# Altium schematic sheet 08.C8051_TIMER_LCD_V1.0.0.SchDoc
size A4
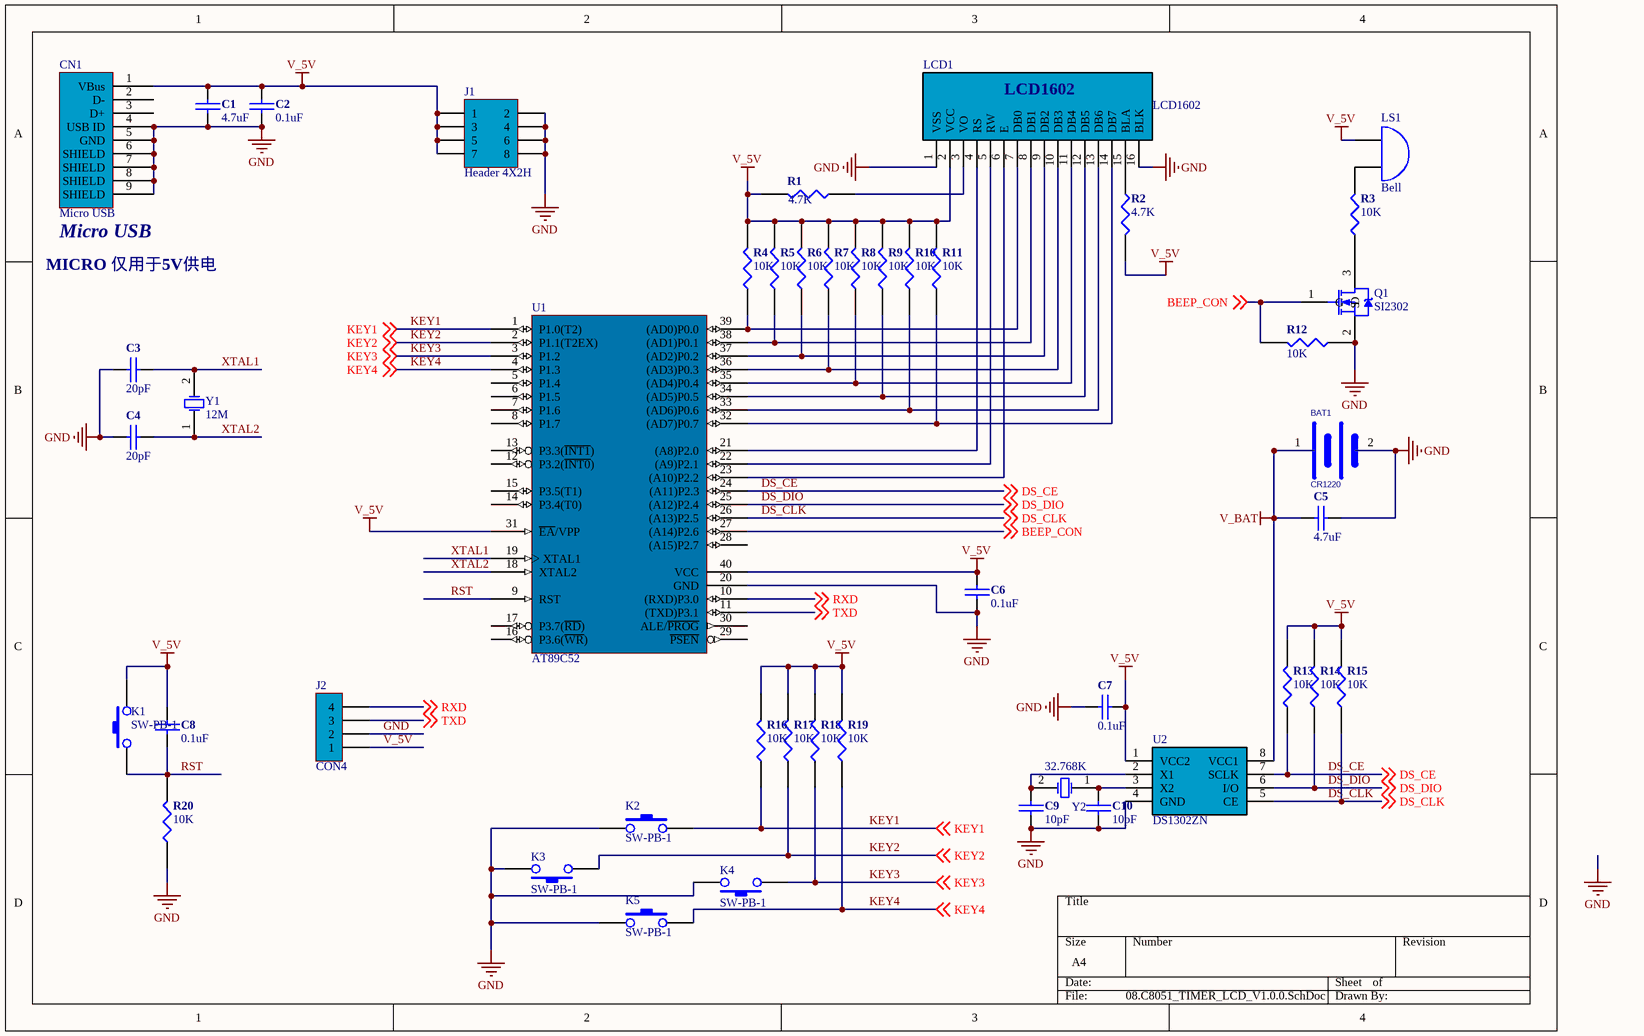
[diagram p0: 08.C8051_TIMER_LCD_V1.0.0.SchDoc]

## Parts
BAT1  CR1220  [BATTERY-CELL]
C1  4.7uF  [C0603]
C2  0.1uF  [C0603]
C3  20pF  [C0603]
C4  20pF  [C0603]
C5  4.7uF  [C0603]
C6  0.1uF  [C0603]
C7  0.1uF  [C0603]
C8  0.1uF  [C0603]
C9  10pF  [C0603]
C10  10pF  [C0603]
CN1  Micro USB  [MICRO_USB_9]
J1  Header 4X2H  [HDR2X4]
J2  CON4  [HDR1X4]
K1  SW-PB-1  [SWITCH_1]
K2  SW-PB-1  [SWITCH_1]
K3  SW-PB-1  [SWITCH_1]
K4  SW-PB-1  [SWITCH_1]
K5  SW-PB-1  [SWITCH_1]
LCD1  LCD1602  [LCD1602]
LS1  Bell  [BUZZER]
Q1  SI2302  [SOT_23(N)]
R1  4.7K  [R0603]
R2  4.7K  [R0603]
R3  10K  [R0603]
R4  10K  [R0603]
R5  10K  [R0603]
R6  10K  [R0603]
R7  10K  [R0603]
R8  10K  [R0603]
R9  10K  [R0603]
R10  10K  [R0603]
R11  10K  [R0603]
R12  10K  [R0603]
R13  10K  [R0603]
R14  10K  [R0603]
R15  10K  [R0603]
R16  10K  [R0603]
R17  10K  [R0603]
R18  10K  [R0603]
R19  10K  [R0603]
R20  10K  [R0603]
U1  AT89C52  [DIP40]
U2  DS1302ZN  [SOP-8]
Y1  12M  [XTAL]
Y2  32.768K  [XTAL_32.768KHz]

## Nets
GND: BAT1.2(GND) C1.1 C2.2 C3.2 C4.2 C5.1 C6.2 C7.1 C9.2 C10.2 CN1.4(USB_ID) CN1.5(GND) CN1.6(SHIELD) CN1.7(SHIELD) CN1.8(SHIELD) CN1.9(SHIELD) J1.2 J1.4 J1.6 J1.8 J2.2 K2.1 K3.2 K4.2 K5.1 LCD1.1(VSS) LCD1.16(BLK) Q1.2(S) R12.1 R20.1 U1.20(GND) U2.4(GND)
V_5V: C1.2 C2.1 C6.1 C7.2 C8.1 CN1.1(VBus) J1.1 J1.3 J1.5 J1.7 J2.1 K1.2 LCD1.2(VCC) LS1.1(A) R1.2 R2.2 R4.2 R5.2 R6.2 R7.2 R8.2 R9.2 R10.2 R11.2 R13.2 R14.2 R15.2 R16.2 R17.2 R18.2 R19.2 U1.31(~{EA}/VPP) U1.40(VCC) U2.1(VCC2)
V_BAT: BAT1.1(+) C5.2 U2.8(VCC1)
BEEP_CON: Q1.1(G) R12.2 U1.27((A14)P2.6) ; off-sheet BEEP_CON
DS_CE: R13.1 U1.24((A11)P2.3) U2.7(SCLK) ; off-sheet DS_CE
DS_CLK: R15.1 U1.26((A13)P2.5) U2.5(CE) ; off-sheet DS_CLK
DS_DIO: R14.1 U1.25((A12)P2.4) U2.6(I/O) ; off-sheet DS_DIO
KEY1: K2.2 R16.1 U1.1(P1.0(T2)) ; off-sheet KEY1
KEY2: K3.1 R17.1 U1.2(P1.1(T2EX)) ; off-sheet KEY2
KEY3: K4.1 R18.1 U1.3(P1.2) ; off-sheet KEY3
KEY4: K5.2 R19.1 U1.4(P1.3) ; off-sheet KEY4
RST: C8.2 K1.1 R20.2 U1.9(RST)
RXD: J2.4 U1.10((RXD)P3.0) ; off-sheet RXD
TXD: J2.3 U1.11((TXD)P3.1) ; off-sheet TXD
XTAL1: C3.1 U1.19(XTAL1) Y1.2(OSC2)
XTAL2: C4.1 U1.18(XTAL2) Y1.1(OSC1)
NetC9_1: C9.1 U2.2(X1) Y2.2(OSC2)
NetC10_1: C10.1 U2.3(X2) Y2.1(OSC1)
NetLCD1_3: LCD1.3(VO) R1.1
NetLCD1_4: LCD1.4(RS) U1.21((A8)P2.0)
NetLCD1_5: LCD1.5(RW) U1.22((A9)P2.1)
NetLCD1_6: LCD1.6(E) U1.23((A10)P2.2)
NetLCD1_7: LCD1.7(DB0) R4.1 U1.39((AD0)P0.0)
NetLCD1_8: LCD1.8(DB1) R5.1 U1.38((AD1)P0.1)
NetLCD1_9: LCD1.9(DB2) R6.1 U1.37((AD2)P0.2)
NetLCD1_10: LCD1.10(DB3) R7.1 U1.36((AD3)P0.3)
NetLCD1_11: LCD1.11(DB4) R8.1 U1.35((AD4)P0.4)
NetLCD1_12: LCD1.12(DB5) R9.1 U1.34((AD5)P0.5)
NetLCD1_13: LCD1.13(DB6) R10.1 U1.33((AD6)P0.6)
NetLCD1_14: LCD1.14(DB7) R11.1 U1.32((AD7)P0.7)
NetLCD1_15: LCD1.15(BLA) R2.1
NetLS1_2: LS1.2(B) R3.2
NetQ1_3: Q1.3(D) R3.1

Not connected (* = marked no-connect by the designer): CN1 2(D-) 3(D+); U1 5(P1.4) 6(P1.5) 7(P1.6) 8(P1.7) 12(P3.2(~{INT0})) 13(P3.3(~{INT1})) 14(P3.4(T0)) 15(P3.5(T1)) 16(P3.6(~{WR})) 17(P3.7(~{RD})) 28((A15)P2.7) 29(~{PSEN}) 30(ALE/~{PROG})

## Notes on the sheet
- MICRO 仅用于5V供电

## Library data of the parts
BAT1 = BATTERY
C1 C3-C5 C9 C10 = CAP: SMT电容; Precision: 6.3V耐压; LIB: SMT电容
C2 C6-C8 = 电容: SMT电容; Precision: 6.3V耐压
CN1 = Mini_USB_3: Micro USBͷ; USAGE: Micro USB
J1 = Header 4X2H: Header, 4-Pin, Dual row, Right Angle; LatestRevisionDate: 17-Jul-2002; LatestRevisionNote: Re-released for DXP Platform.; Publisher: Altium Limited
J2 = CON4: Connector
K1-K5 = SW-PB-1: 轻触按键
LS1 = Bell: Electrical Bell; Published: 24-Mar-1999; LatestRevisionDate: 17-Jul-2002; LatestRevisionNote: Re-released for DXP Platform.; PackageReference: PIN2; Publisher: Altium Limited
Q1 = NMOS-2: N-Channel Power MOSFET; Note: Pin 2 is electrically connected to pin 4.; Published: 8-Jun-2000; LatestRevisionDate: 17-Jul-2002; LatestRevisionNote: Re-released for DXP Platform.; DatasheetVersion: PD-9.814; PackageVersion: Feb-1997; PackageReference: TO-220AB; Publisher: Altium Limited; PackageDescription: TO, Thru-Hole, Vertical, Heatsink Mounted; 3 In-Line Leads; Pitch 2.54 mm; ComponentLink1Description: Manufacturer Link; ComponentLink1URL: http://www.irf.com/
R1-R20 = RES1: SMT电阻; Precision: 5% 精度; LIB: SMT 电阻
U1 = AT89C52: 8-Bit Microcontroller with 8K Flash ROM
U2 = DS1302
Y1 Y2 = XTAL: Crystal Oscillator; Published: 8-Jun-2000; LatestRevisionDate: 17-Jul-2002; LatestRevisionNote: Re-released for DXP Platform.; Publisher: Altium Limited